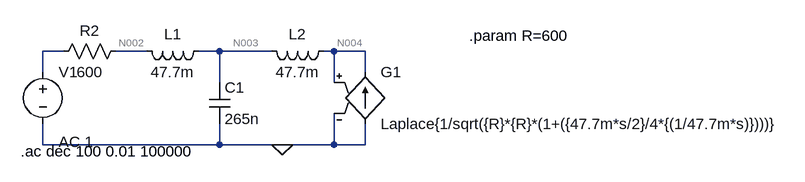
[diagram p0: schematic Draft1.asc]
Draft1.asc, the LTspice schematic file:
Version 4
SHEET 1 1204 680
WIRE -64 128 -96 128
WIRE 64 128 16 128
WIRE 176 128 144 128
WIRE 256 128 176 128
WIRE 352 128 336 128
WIRE 400 128 352 128
WIRE -96 160 -96 128
WIRE 400 160 400 128
WIRE 176 176 176 128
WIRE 352 176 352 128
WIRE -96 272 -96 240
WIRE 176 272 176 240
WIRE 176 272 -96 272
WIRE 272 272 176 272
WIRE 352 272 352 224
WIRE 352 272 272 272
WIRE 400 272 400 240
WIRE 400 272 352 272
FLAG 272 272 0
SYMBOL ind 160 112 R90
WINDOW 0 5 56 VBottom 2
WINDOW 3 32 56 VTop 2
SYMATTR InstName L1
SYMATTR Value 47.7m
SYMBOL ind 352 112 R90
WINDOW 0 5 56 VBottom 2
WINDOW 3 32 56 VTop 2
SYMATTR InstName L2
SYMATTR Value 47.7m
SYMBOL cap 160 176 R0
SYMATTR InstName C1
SYMATTR Value 265n
SYMBOL res 32 112 R90
WINDOW 0 0 56 VBottom 2
WINDOW 3 32 56 VTop 2
SYMATTR InstName R2
SYMATTR Value 600
SYMBOL voltage -96 144 R0
WINDOW 123 24 124 Left 2
WINDOW 39 0 0 Left 0
SYMATTR InstName V1
SYMATTR Value ""
SYMATTR Value2 AC 1
SYMBOL g 400 144 R0
SYMATTR InstName G1
SYMATTR Value Laplace{1/sqrt({R}*{R}*(1+({47.7m*s/2}/4*{(1/47.7m*s)})))}
TEXT -130 282 Left 2 !.ac dec 100 0.01 100000
TEXT 560 104 Left 2 !.param R=600

The netlist it stands for:
* Draft1.asc
L1 N003 N002 47.7m
L2 N004 N003 47.7m
C1 N003 0 265n
R2 N002 N001 600
V1 N001 0 AC 1
G1 0 N004 N004 0 Laplace{1/sqrt({R}*{R}*(1+({47.7m*s/2}/4*{(1/47.7m*s)})))}
.ac dec 100 0.01 100000
.param R=600
.backanno
.end

* Results of the author's LTspice run, read from the files saved beside the schematic
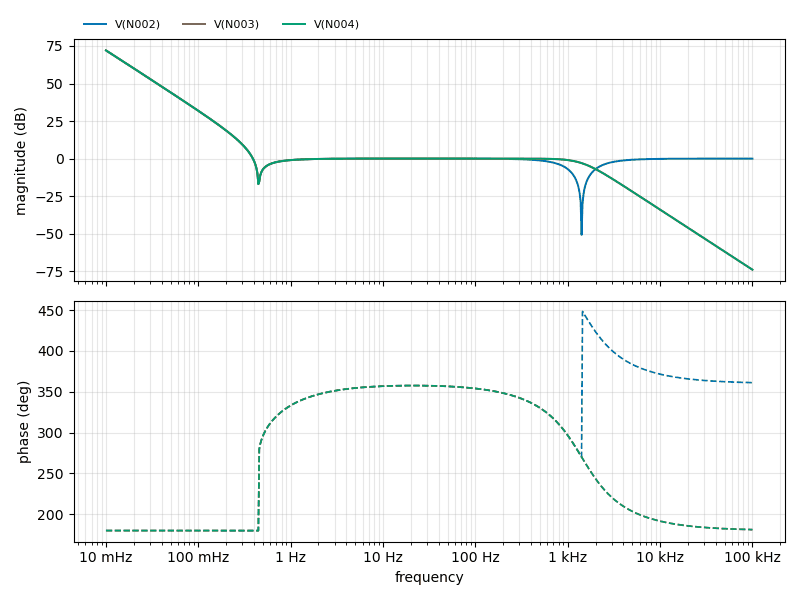
[diagram p1: AC Analysis of Draft1.asc, plotted from the saved traces]
* AC Analysis, 1 run:
*   V(N002): 72.04 dB at 10 mHz, -0.00 dB at 100 kHz, peak 72.04 dB at 10 mHz, 3 dB below the peak at 11.91 mHz
*   V(N003): 72.04 dB at 10 mHz, -73.96 dB at 100 kHz, peak 72.04 dB at 10 mHz, 3 dB below the peak at 11.91 mHz
*   V(N004): 72.04 dB at 10 mHz, -73.96 dB at 100 kHz, peak 72.04 dB at 10 mHz, 3 dB below the peak at 11.91 mHz